# Altium schematic sheet isolate.SchDoc
size A3
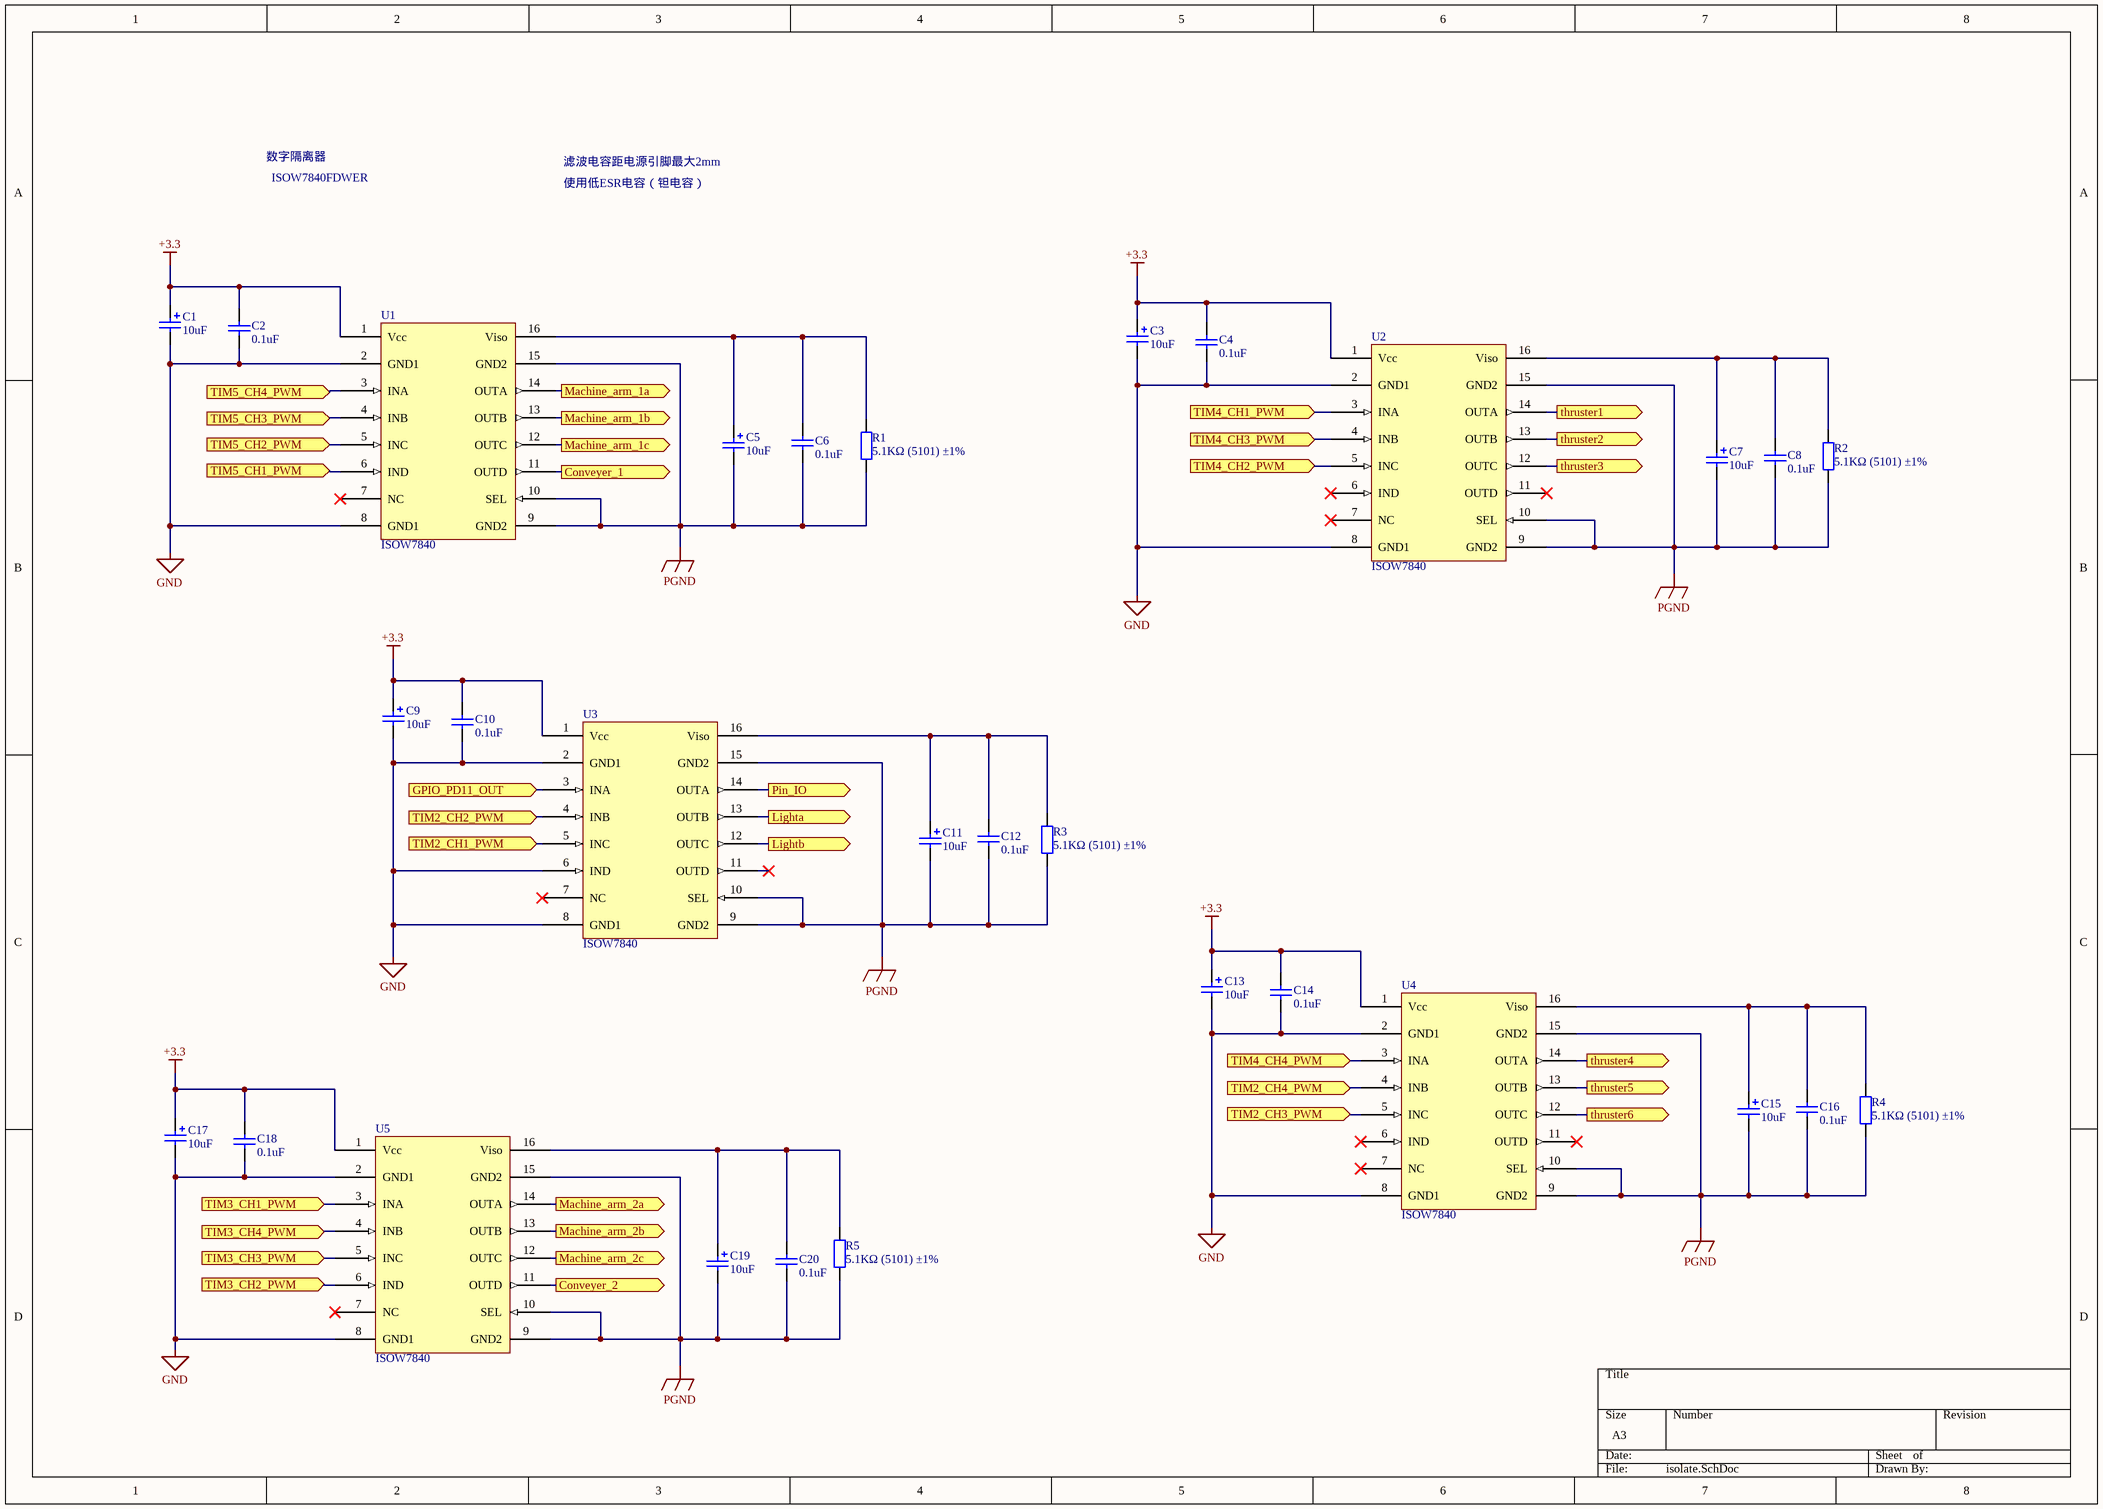
[diagram p0: isolate.SchDoc]

## Parts
C1  10uF  [CASE-B_3528]
C2  0.1uF  [0603_C]
C3  10uF  [CASE-B_3528]
C4  0.1uF  [0603_C]
C5  10uF  [CASE-B_3528]
C6  0.1uF  [0603_C]
C7  10uF  [CASE-B_3528]
C8  0.1uF  [0603_C]
C9  10uF  [CASE-B_3528]
C10  0.1uF  [0603_C]
C11  10uF  [CASE-B_3528]
C12  0.1uF  [0603_C]
C13  10uF  [CASE-B_3528]
C14  0.1uF  [0603_C]
C15  10uF  [CASE-B_3528]
C16  0.1uF  [0603_C]
C17  10uF  [CASE-B_3528]
C18  0.1uF  [0603_C]
C19  10uF  [CASE-B_3528]
C20  0.1uF  [0603_C]
R1  5.1KΩ (5101) ±1%  [0805_R]
R2  5.1KΩ (5101) ±1%  [0805_R]
R3  5.1KΩ (5101) ±1%  [0805_R]
R4  5.1KΩ (5101) ±1%  [0805_R]
R5  5.1KΩ (5101) ±1%  [0805_R]
U1  ISOW7840  [ISOW7840]
U2  ISOW7840  [ISOW7840]
U3  ISOW7840  [ISOW7840]
U4  ISOW7840  [ISOW7840]
U5  ISOW7840  [ISOW7840]

## Ports
Conveyer_1 (out), Conveyer_2 (out), GPIO_PD11_OUT (in), Lighta (out), Lightb (out), Machine_arm_1a (out), Machine_arm_1b (out), Machine_arm_1c (out), Machine_arm_2a (out), Machine_arm_2b (out), Machine_arm_2c (out), Pin_IO (out), thruster1 (out), thruster2 (out), thruster3 (out), thruster4 (out), thruster5 (out), thruster6 (out), TIM2_CH1_PWM (in), TIM2_CH2_PWM (in), TIM2_CH3_PWM (in), TIM2_CH4_PWM (in), TIM3_CH1_PWM (in), TIM3_CH2_PWM (in), TIM3_CH3_PWM (in), TIM3_CH4_PWM (in), TIM4_CH1_PWM (in), TIM4_CH2_PWM (in), TIM4_CH3_PWM (in), TIM4_CH4_PWM (in), TIM5_CH1_PWM (in), TIM5_CH2_PWM (in), TIM5_CH3_PWM (in), TIM5_CH4_PWM (in)

## Nets
+3.3: C1.1 C2.2 C3.1 C4.2 C9.1 C10.2 C13.1 C14.2 C17.1 C18.2 U1.1(Vcc) U2.1(Vcc) U3.1(Vcc) U4.1(Vcc) U5.1(Vcc)
GND: C1.2 C2.1 C3.2 C4.1 C9.2 C10.1 C13.2 C14.1 C17.2 C18.1 U1.2(GND1) U1.8(GND1) U2.2(GND1) U2.8(GND1) U3.2(GND1) U3.6(IND) U3.8(GND1) U4.2(GND1) U4.8(GND1) U5.2(GND1) U5.8(GND1)
PGND: C5.2 C6.1 C7.2 C8.1 C11.2 C12.1 C15.2 C16.1 C19.2 C20.1 R1.1 R2.1 R3.1 R4.1 R5.1 U1.9(GND2) U1.10(SEL) U1.15(GND2) U2.9(GND2) U2.10(SEL) U2.15(GND2) U3.9(GND2) U3.10(SEL) U3.15(GND2) U4.9(GND2) U4.10(SEL) U4.15(GND2) U5.9(GND2) U5.10(SEL) U5.15(GND2)
Conveyer_1: U1.11(OUTD) ; port Conveyer_1
Conveyer_2: U5.11(OUTD) ; port Conveyer_2
GPIO_PD11_OUT: U3.3(INA) ; port GPIO_PD11_OUT
Lighta: U3.13(OUTB) ; port Lighta
Lightb: U3.12(OUTC) ; port Lightb
Machine_arm_1a: U1.14(OUTA) ; port Machine_arm_1a
Machine_arm_1b: U1.13(OUTB) ; port Machine_arm_1b
Machine_arm_1c: U1.12(OUTC) ; port Machine_arm_1c
Machine_arm_2a: U5.14(OUTA) ; port Machine_arm_2a
Machine_arm_2b: U5.13(OUTB) ; port Machine_arm_2b
Machine_arm_2c: U5.12(OUTC) ; port Machine_arm_2c
Pin_IO: U3.14(OUTA) ; port Pin_IO
thruster1: U2.14(OUTA) ; port thruster1
thruster2: U2.13(OUTB) ; port thruster2
thruster3: U2.12(OUTC) ; port thruster3
thruster4: U4.14(OUTA) ; port thruster4
thruster5: U4.13(OUTB) ; port thruster5
thruster6: U4.12(OUTC) ; port thruster6
TIM2_CH1_PWM: U3.5(INC) ; port TIM2_CH1_PWM
TIM2_CH2_PWM: U3.4(INB) ; port TIM2_CH2_PWM
TIM2_CH3_PWM: U4.5(INC) ; port TIM2_CH3_PWM
TIM2_CH4_PWM: U4.4(INB) ; port TIM2_CH4_PWM
TIM3_CH1_PWM: U5.3(INA) ; port TIM3_CH1_PWM
TIM3_CH2_PWM: U5.6(IND) ; port TIM3_CH2_PWM
TIM3_CH3_PWM: U5.5(INC) ; port TIM3_CH3_PWM
TIM3_CH4_PWM: U5.4(INB) ; port TIM3_CH4_PWM
TIM4_CH1_PWM: U2.3(INA) ; port TIM4_CH1_PWM
TIM4_CH2_PWM: U2.5(INC) ; port TIM4_CH2_PWM
TIM4_CH3_PWM: U2.4(INB) ; port TIM4_CH3_PWM
TIM4_CH4_PWM: U4.3(INA) ; port TIM4_CH4_PWM
TIM5_CH1_PWM: U1.6(IND) ; port TIM5_CH1_PWM
TIM5_CH2_PWM: U1.5(INC) ; port TIM5_CH2_PWM
TIM5_CH3_PWM: U1.4(INB) ; port TIM5_CH3_PWM
TIM5_CH4_PWM: U1.3(INA) ; port TIM5_CH4_PWM
NetC5_1: C5.1 C6.2 R1.2 U1.16(Viso)
NetC7_1: C7.1 C8.2 R2.2 U2.16(Viso)
NetC11_1: C11.1 C12.2 R3.2 U3.16(Viso)
NetC15_1: C15.1 C16.2 R4.2 U4.16(Viso)
NetC19_1: C19.1 C20.2 R5.2 U5.16(Viso)

Not connected (* = marked no-connect by the designer): U1 7(NC)*; U2 6(IND)* 7(NC)* 11(OUTD)*; U3 7(NC)* 11(OUTD)*; U4 6(IND)* 7(NC)* 11(OUTD)*; U5 7(NC)*

## Notes on the sheet
- 数字隔离器
- ISOW7840FDWER
- 滤波电容距电源引脚最大2mm
- 使用低ESR电容（钽电容）

## Library data of the parts
C1 C3 C5 C7 C9 C11 C13 C15 C17 C19 = 3528 100uF (107) 10% 6.3V: 钽电容; ComponentLink1Description: 供应商链接; ComponentLink1URL: http://www.szlcsc.com/product/details_16815.html; Package: 3528; Supplier: LC; SuppliersPartNumber: C16133
C2 C4 C6 C8 C10 C12 C14 C16 C18 C20 = 0603 100nF (104) 10% 50V: 贴片电容; ComponentLink1Description: 供应商链接; ComponentLink1URL: http://www.szlcsc.com/product/details_15331.html; Package: 0603; Supplier: LC; SuppliersPartNumber: C14663
R1-R5 = 0805 5.1KΩ (5101) 1%: 贴片电阻; ComponentLink1Description: 供应商链接; ComponentLink1URL: http://www.szlcsc.com/product/details_28584.html; Package: 0805; Supplier: LC; SuppliersPartNumber: C27834